# EAGLE schematic Control Acceso Doble Faz (EAGLE 9.6.2)
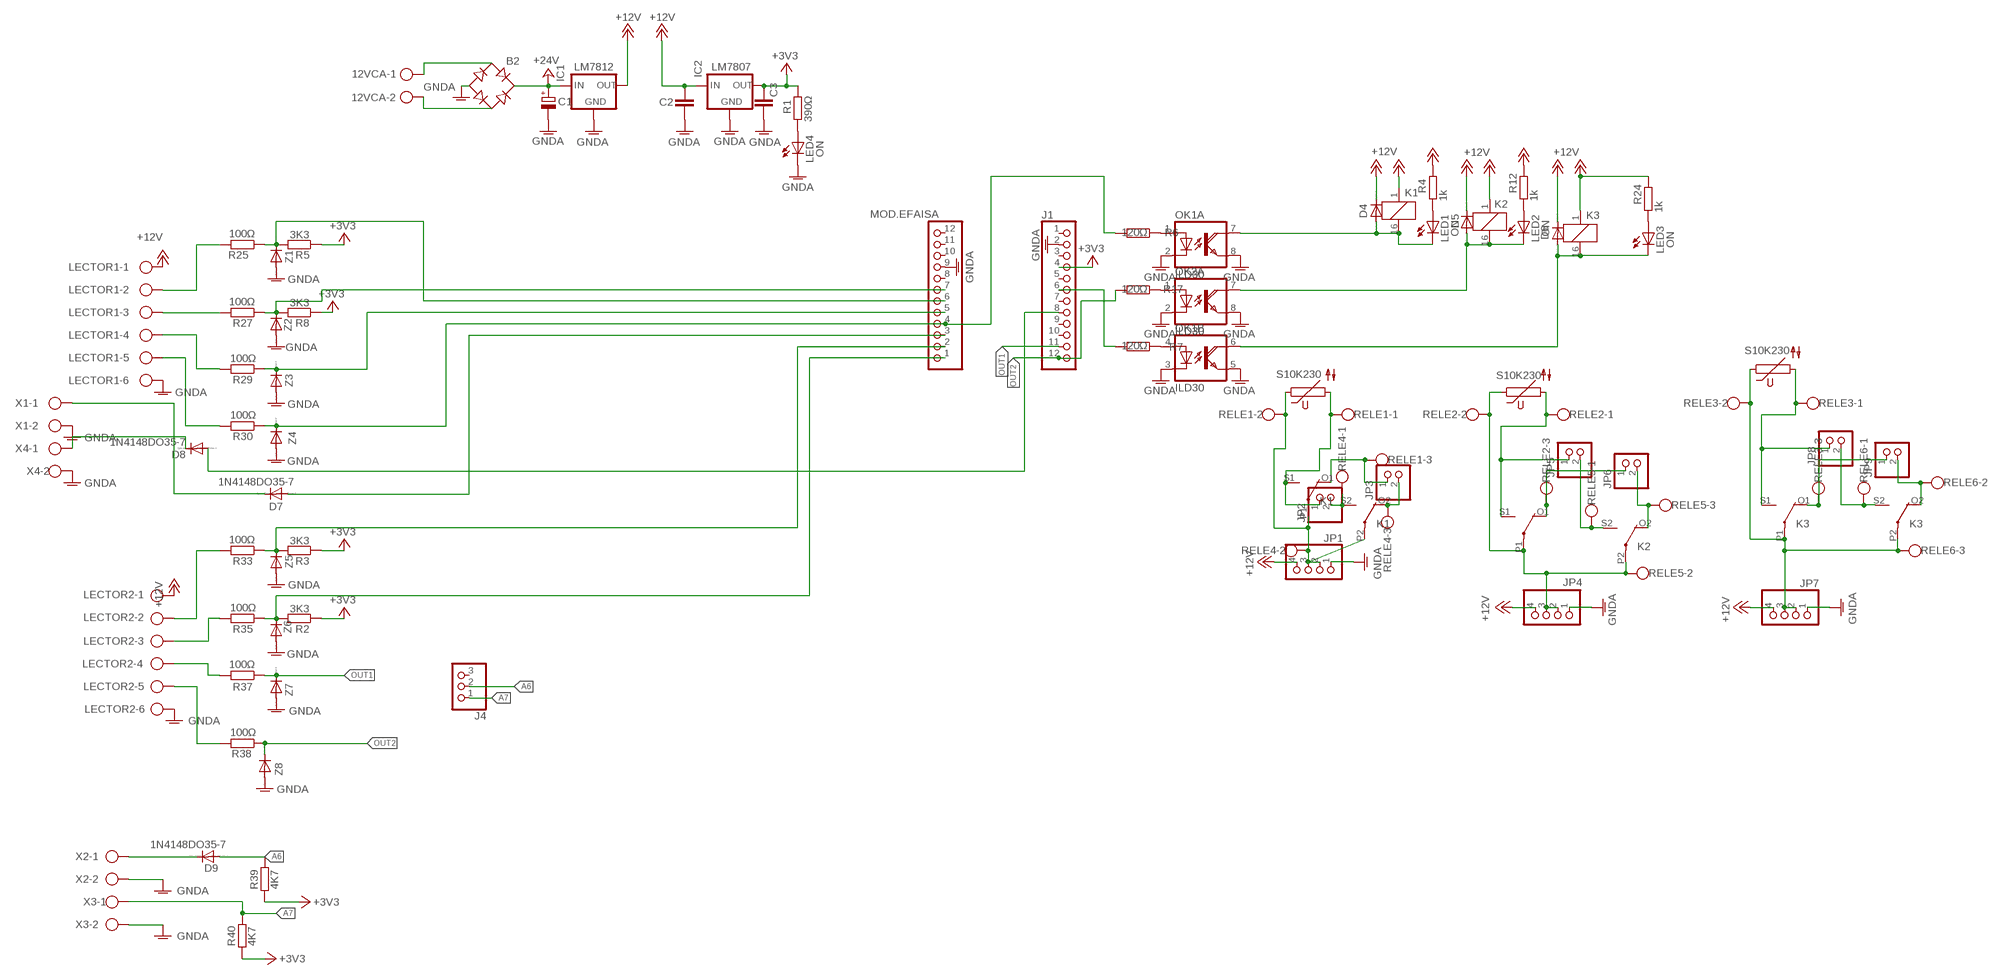
[diagram p0: schematic, sheet 1]

## Parts
12VCA  W237-102  [W237-102]
B2  RB1A  [RB1A]
C1  CPOL-EUE5-13  [E5-13]
C2  C-EU050-024X044  [C050-024X044]
C3  C-EU050-024X044  [C050-024X044]
D4  1N4148DO35-7  [DO35-7]
D5  1N4148DO35-7  [DO35-7]
D6  1N4148DO35-7  [DO35-7]
D7  1N4148DO35-7  [DO35-7]
D8  1N4148DO35-7  [DO35-7]
D9  1N4148DO35-7  [DO35-7]
IC1  LM7812  78XXS  [78XXS]
IC2  LM7807  78XXS  [78XXS]
J1  PINHD-1X12  [1X12]
J4  PINHD-1X3  [1X03]
JP1  PINHD-1X4  [1X04]
JP2  PINHD-1X2  [1X02]
JP3  PINHD-1X2  [1X02]
JP4  PINHD-1X4  [1X04]
JP5  PINHD-1X2  [1X02]
JP6  PINHD-1X2  [1X02]
JP7  PINHD-1X4  [1X04]
JP8  PINHD-1X2  [1X02]
JP9  PINHD-1X2  [1X02]
K1  351  [351]
K2  351  [351]
K3  351  [351]
LECTOR1  W237-6  [W237-6]
LECTOR2  W237-6  [W237-6]
LED1  ON  LED3MM  [LED3MM]
LED2  ON  LED3MM  [LED3MM]
LED3  ON  LED3MM  [LED3MM]
LED4  ON  LED3MM  [LED3MM]
MOD.EFAISA  PINHD-1X12  [1X12]
OK1  ILD30  [DIL08]
OK2  ILD30  [DIL08]
R1  390Ω  R-EU_0204/7  [0204/7]
R2  3K3  R-EU_0204/7  [0204/7]
R3  3K3  R-EU_0204/7  [0204/7]
R4  1k  R-EU_0204/7  [0204/7]
R5  3K3  R-EU_0204/7  [0204/7]
R6  120Ω  R-EU_0204/7  [0204/7]
R7  120Ω  R-EU_0204/7  [0204/7]
R8  3K3  R-EU_0204/7  [0204/7]
R12  1k  R-EU_0204/7  [0204/7]
R17  120Ω  R-EU_0204/7  [0204/7]
R24  1k  R-EU_0204/7  [0204/7]
R25  100Ω  R-EU_0204/7  [0204/7]
R27  100Ω  R-EU_0204/7  [0204/7]
R29  100Ω  R-EU_0204/7  [0204/7]
R30  100Ω  R-EU_0204/7  [0204/7]
R33  100Ω  R-EU_0204/7  [0204/7]
R35  100Ω  R-EU_0204/7  [0204/7]
R37  100Ω  R-EU_0204/7  [0204/7]
R38  100Ω  R-EU_0204/7  [0204/7]
R39  4K7  R-EU_0204/7  [0204/7]
R40  4K7  R-EU_0204/7  [0204/7]
RELE1  W237-103  [W237-103]
RELE2  W237-103  [W237-103]
RELE3  W237-103  [W237-103]
RELE4  W237-103  [W237-103]
RELE5  W237-103  [W237-103]
RELE6  W237-103  [W237-103]
V1  S10K230  [S10K230]
V2  S10K230  [S10K230]
V3  S10K230  [S10K230]
X1  W237-102  [W237-102]
X2  W237-102  [W237-102]
X3  W237-102  [W237-102]
X4  W237-102  [W237-102]
Z1  ZENNER 4V7  1N4148DO35-7  [DO35-7]
Z2  ZENNER 4V7  1N4148DO35-7  [DO35-7]
Z3  ZENNER 4V7  1N4148DO35-7  [DO35-7]
Z4  ZENNER 4V7  1N4148DO35-7  [DO35-7]
Z5  ZENNER 4V7  1N4148DO35-7  [DO35-7]
Z6  ZENNER 4V7  1N4148DO35-7  [DO35-7]
Z7  ZENNER 4V7  1N4148DO35-7  [DO35-7]
Z8  ZENNER 4V7  1N4148DO35-7  [DO35-7]

## Nets
+3V3 [normal]: C3.1 IC2.OUT J1.4 R1.2 R2.1 R3.1 R5.1 R8.1 R39.1 R40.1
+12V [normal]: C2.1 D4.C D5.C D6.C IC1.OUT IC2.IN JP1.4 JP4.4 JP7.4 K1.1 K2.1 K3.1 LECTOR1.1 LECTOR2.1 R4.2 R12.2 R24.2
+24V [normal]: B2.+ C1.+ IC1.IN
A6 [fina]: D9.A J4.2 R39.2
A7 [fina]: J4.1 R40.2 X3.1
GNDA [normal]: B2.- C1.- C2.2 C3.2 IC1.GND IC2.GND J1.2 JP1.1 JP4.1 JP7.1 LECTOR1.6 LECTOR2.6 LED4.K(C) MOD.EFAISA.9 OK1.2(A:C) OK1.3(B:C) OK1.5(B:EMI) OK1.8(A:EMI) OK2.2(A:C) OK2.8(A:EMI) X1.2 X2.2 X3.2 X4.2 Z1.A Z2.A Z3.A Z4.A Z5.A Z6.A Z7.A Z8.A
N$1 [normal]: 12VCA.1 B2.AC1
N$2 [normal]: 12VCA.2 B2.AC2
N$3 [fina]: MOD.EFAISA.4 R6.2 R30.1 Z4.C
N$9 [fina]: MOD.EFAISA.6 R5.2 R25.1 Z1.C
N$10 [fina]: D7.A MOD.EFAISA.3
N$12 [normal]: J1.6 R7.2
N$13: OK1.1(A:A) R6.1
N$14: OK2.1(A:A) R17.1
N$15 [fina]: MOD.EFAISA.7 R8.2 R27.1 Z2.C
N$16: OK1.4(B:A) R7.1
N$17 [normal]: D4.A K1.16 LED1.K(C) OK1.7(A:COL)
N$18 [normal]: D5.A K2.16 LED2.K(C) OK2.7(A:COL)
N$19 [normal]: D6.A K3.16 LED3.K(C) OK1.6(B:COL)
N$20: JP9.1 K3.O1(2:O) RELE3.3
N$21 [normal]: LECTOR1.2 R25.2
N$22 [normal]: LECTOR1.3 R27.2
N$23 [fina]: MOD.EFAISA.5 R29.1 Z3.C
N$24 [fina]: MOD.EFAISA.2 R3.2 R33.1 Z5.C
N$25 [normal]: LECTOR1.4 R29.2
N$26 [normal]: LECTOR2.2 R33.2
N$27 [fina]: MOD.EFAISA.1 R2.2 R35.1 Z6.C
N$30 [normal]: LECTOR1.5 R30.2
N$31 [fina]: D7.C X1.1
N$33 [normal]: LECTOR2.3 R35.2
N$34 [normal]: LECTOR2.4 R37.2
N$36 [normal]: LED4.A R1.1
N$37 [normal]: JP6.1 K2.O1(2:O) RELE2.3
N$38: JP2.2 K1.S2(3:S) RELE4.1
N$40: JP3.2 K1.O2(3:O) RELE4.3
N$41 [normal]: JP3.1 K1.O1(2:O) RELE1.3
N$42 [normal]: LED3.A R24.1
N$44: JP6.2 K2.O2(3:O) RELE5.3
N$45 [normal]: JP7.2 JP7.3 K3.P1(2:P) K3.P2(3:P) RELE3.2 RELE6.3 V3.1
N$46 [normal]: LECTOR2.5 R38.2
N$47 [normal]: D9.C X2.1
N$50: JP5.2 K2.S2(3:S) RELE5.1
N$52: JP8.2 K3.S2(3:S) RELE6.1
N$53 [normal]: LED2.A R12.1
N$54 [normal]: LED1.A R4.1
N$55: JP1.2 JP1.3 K1.P1(2:P) K1.P2(3:P) RELE1.2 RELE4.2 V1.1
N$56: JP2.1 K1.S1(2:S) RELE1.1 V1.2
N$57: JP9.2 K3.O2(3:O) RELE6.2
N$58: JP5.1 K2.S1(2:S) RELE2.1 V2.2
N$59: JP4.2 JP4.3 K2.P1(2:P) K2.P2(3:P) RELE2.2 RELE5.2 V2.1
N$60: JP8.1 K3.S1(2:S) RELE3.1 V3.2
N$61 [fina]: D8.A J1.8
N$62 [fina]: D8.C X4.1
OUT1 [fina]: J1.11 R37.1 Z7.C
OUT2 [fina]: J1.12 R17.2 R38.1 Z8.C
Unconnected: J1.1 J1.3 J1.5 J1.7 J1.9 J1.10 J4.3 MOD.EFAISA.8 MOD.EFAISA.10 MOD.EFAISA.11 MOD.EFAISA.12 OK2.3(B:C) OK2.4(B:A) OK2.5(B:EMI) OK2.6(B:COL)

## Library data of the parts
12VCA X1-X4 = con-wago-500:W237-102: WAGO SCREW CLAMP; MPN: 237-102; OC_FARNELL: unknown; OC_NEWARK: 70K9898
B2 = rectifier:RB1A: RECTIFIER 1 A
C1 = rcl:CPOL-EU: POLARIZED CAPACITOR, European symbol
C2 C3 = rcl:C-EU: CAPACITOR, European symbol
D4-D9 Z1-Z8 = diode:1N4148: DIODE high speed (Philips)
IC1 IC2 = v-reg:78XXS: VOLTAGE REGULATOR
J1 MOD.EFAISA = pinhead:PINHD-1X12: PIN HEADER
J4 = pinhead:PINHD-1X3: PIN HEADER
JP1 JP4 JP7 = pinhead:PINHD-1X4: PIN HEADER
JP2 JP3 JP5 JP6 JP8 JP9 = pinhead:PINHD-1X2: PIN HEADER
K1-K3 = relay:351: RELAY 2 x switch, Omron; OC_FARNELL: unknown; OC_NEWARK: unknown
LECTOR1 LECTOR2 = con-wago-500:W237-6: WAGO SCREW CLAMP; OC_FARNELL: unknown; OC_NEWARK: unknown
LED1-LED4 = led:LED: LED OSRAM: - CHIPLED LG R971, LG N971, LY N971, LG Q971, LY Q971, LO R971, LY R971 LH N974, LH R974 LS Q976, LO Q976, LY Q976 LO Q996 - Hyper CHIPLED LW Q18S LB Q993, LB Q99A, LB R99A - SideLED LS A670, LO A670, LY A670, LG A670, LP A670 LB A673, LV A673, LT A673, LW A673 LH A674 LY A675 LS A676, LA A676, LO A676, LY A676, LW A676 LS A679, LY A679, LG A679 - Hyper Micro SIDELED® LS Y876, LA Y876, LO Y876, LY Y876 LT Y87S - SmartLED LW L88C, LW L88S LB L89C, LB L89S, LG L890 LS L89K, LO L89K, LY L89K LS L896, LA L896, LO L896, LY L896 - TOPLED LS T670, LO T670, LY T670, LG T670, LP T670 LSG T670, LSP T670, LSY T670, LOP T670, LYG T670 LG T671, LOG T671, LSG T671 LB T673, LV T673, LT T673, LW T673 LH T674 LS T676, LA T676, LO T676, LY T676, LB T676, LH T676, LSB T676, LW T676 LB T67C, LV T67C, LT T67C, LS T67K, LO T67K, LY T67K, LW E67C LS E67B, LA E67B, LO E67B, LY E67B, LB E67C, LV E67C, LT E67C LW T67C LS T679, LY T679, LG T679 LS T770, LO T770, LY T770, LG T770, LP T770 LB T773, LV T773, LT T773, LW T773 LH T774 LS E675, LA E675, LY E675, LS T675 LS T776, LA T776, LO T776, LY T776, LB T776 LHGB T686 LT T68C, LB T68C - Hyper Mini TOPLED® LB M676 - Mini TOPLED Santana® LG M470 LS M47K, LO M47K, LY M47K Source: http://www.osram.convergy.de LUXEON: - LUMILED® LXK2-PW12-R00, LXK2-PW12-S00, LXK2-PW14-U00, LXK2-PW14-V00 LXK2-PM12-R00, LXK2-PM12-S00, LXK2-PM14-U00 LXK2-PE12-Q00, LXK2-PE12-R00, LXK2-PE12-S00, LXK2-PE14-T00, LXK2-PE14-U00 LXK2-PB12-K00, LXK2-PB12-L00, LXK2-PB12-M00, LXK2-PB14-N00, LXK2-PB14-P00, LXK2-PB14-Q00 LXK2-PR12-L00, LXK2-PR12-M00, LXK2-PR14-Q00, LXK2-PR14-R00 LXK2-PD12-Q00, LXK2-PD12-R00, LXK2-PD12-S00 LXK2-PH12-R00, LXK2-PH12-S00 LXK2-PL12-P00, LXK2-PL12-Q00, LXK2-PL12-R00 Source: www.luxeon.com KINGBRIGHT: KA-3528ASYC Source: www.kingbright.com
OK1 OK2 = optocoupler:ILD30: SIEMENS OPTO COUPLER; MF: VISHAY/TELEFUNKEN; MPN: ILD30; OC_FARNELL: 1612448; OC_NEWARK: 58K1668
R1-R8 R12 R17 R24 R25 R27 R29 R30 R33 R35 R37-R40 = rcl:R-EU_: RESISTOR, European symbol
RELE1-RELE6 = con-wago-500:W237-103: WAGO SCREW CLAMP; MPN: 237-103; OC_FARNELL: unknown; OC_NEWARK: 18M7116
V1-V3 = varistor:S10K230: VARISTOR

## Net classes
0 gruesa: width 0.9 mm, drill 0.508 mm, clearance 0.559 mm
1 normal: width 0.8 mm, drill 0.508 mm, clearance 0.559 mm
2 fina: width 0.5 mm, drill 0.508 mm, clearance 0.381 mm
3 Ultra Fina: width 0.4 mm, drill 0.508 mm, clearance 0.254 mm